# Altium project Module_sim.PrjPcb
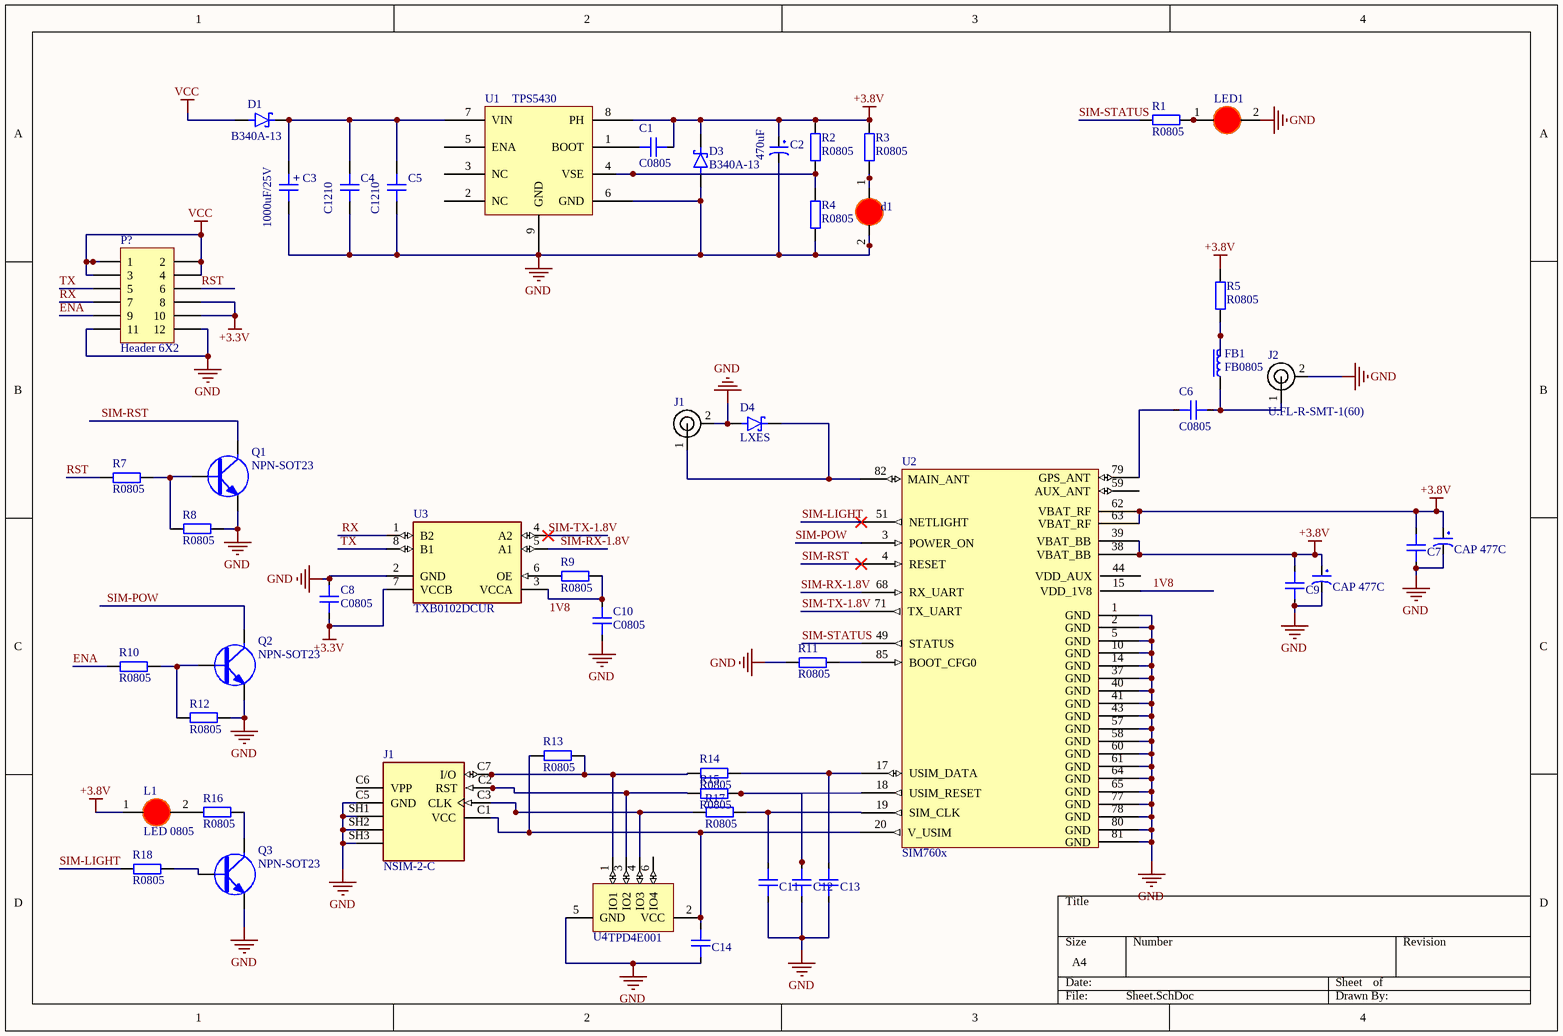
[diagram p0: Sheet.SchDoc]
1 sheet, 51 parts. Net scope: global (net labels, ports and power ports of the same name join across sheets).
Board file: PCB1.PcbDoc

## Sheet Sheet.SchDoc
size A4; SheetNumber: 1; SheetTotal: 1

### Parts
(Parts that share a designator on the sheet are numbered #1, #2 ... from top to bottom, then left to right.)
C1  C0805  [CAP_0805]
C2  470uF  [tu tantalum smd7343]
C3  1000uF/25V  [CAP_AE_SMD_D6MM3_H5M55]
C4  C1210  [CAP_1210]
C5  C1210  [CAP_1210]
C6  C0805  [CAP_0805]
C7  C0805  [CAP_0805]  (value not drawn)
C8  C0805  [CAP_0805]
C9  C0805  [CAP_0805]  (value not drawn)
C10  C0805  [CAP_0805]
C11  C0805  [CAP_0805]  (value not drawn)
C12  C0805  [CAP_0805]  (value not drawn)
C13  C0805  [CAP_0805]  (value not drawn)
C14  C0805  [CAP_0805]  (value not drawn)
D1#1  B340A-13  [B340A]
d1#2  LED_0805_RED  [LED-0805-Red]  (value not drawn)
D3  B340A-13  [B340A]
D4  LXES  [B340A]
FB1  FB0805  [FB_0805]
J1#1  U.FL-R-SMT-1(60)  [U.FL-R-SMT-1(60)]  (value not drawn)
J1#2  NSIM-2-C  [CUI_NSIM-2-C]
J2  U.FL-R-SMT-1(60)  [U.FL-R-SMT-1(60)]
L1  LED 0805  [LED-0805-Red]
LED1  LED 0805  [LED-0805-Red]  (value not drawn)
P?  Header 6X2  [HDR2X6]
Q1  NPN-SOT23  [SOT23 - 3PIN]
Q2  NPN-SOT23  [SOT23 - 3PIN]
Q3  NPN-SOT23  [SOT23 - 3PIN]
R1  R0805  [RES_0805]
R2  R0805  [RES_0805]
R3  R0805  [RES_0805]
R4  R0805  [RES_0805]
R5  R0805  [RES_0805]
R7  R0805  [RES_0805]
R8  R0805  [RES_0805]
R9  R0805  [RES_0805]
R10  R0805  [RES_0805]
R11  R0805  [RES_0805]
R12  R0805  [RES_0805]
R13  R0805  [RES_0805]
R14  R0805  [RES_0805]
R15  R0805  [RES_0805]
R16  R0805  [RES_0805]
R17  R0805  [RES_0805]
R18  R0805  [RES_0805]
Tụ_tantalum_1  CAP 477C  [tu tantalum smd7343]
Tụ_tantalum_2  CAP 477C  [tu tantalum smd7343]
U1  TPS5430  [TPS5430DDAR]
U2  SIM760x  [SIM7600CE]
U3  TXB0102DCUR  [txb0102]
U4  TPD4E001  [TSOT-26-6]

### Nets
+3.3V: C8.1 P?.8 P?.10 U3.7(VCCB)
+3.8V: C1.2 C2.1 C7.1 C9.1 D3.C L1.1(A) R2.2 R3.2 R5.2 Tụ_tantalum_1.1 Tụ_tantalum_2.1 U1.8(PH) U2.38(VBAT_BB) U2.39(VBAT_BB) U2.62(VBAT_RF) U2.63(VBAT_RF)
GND: C2.2 C3.2 C4.1 C5.1 C7.2 C8.2 C9.2 C10.2 C11.1 C12.1 C13.1 C14.1 d1#2.2(K) D3.A D4.A J1#1.2 J1#2.C5(GND) J1#2.SH1(CASE_GND) J1#2.SH2(CASE_GND) J1#2.SH3(CASE_GND) J2.2 LED1.2(K) P?.11 P?.12 Q1.2(E) Q2.2(E) Q3.2(E) R4.1 R8.1 R11.2 R12.1 Tụ_tantalum_1.2 Tụ_tantalum_2.2 U1.6(GND) U1.9(GND) U2.1(GND) U2.2(GND) U2.5(GND) U2.10(GND) U2.14(GND) U2.37(GND) U2.40(GND) U2.41(GND) U2.43(GND) U2.57(GND) U2.58(GND) U2.60(GND) U2.61(GND) U2.64(GND) U2.65(GND) U2.77(GND) U2.78(GND) U2.80(GND) U2.81(GND) U3.2(GND) U4.5(GND)
VCC: D1#1.A P?.1 P?.2 P?.3 P?.4
1V8: C10.1 R9.1 U2.15(VDD_1V8) U3.3(VCCA)
ENA: P?.9 R10.2
RST: P?.6 R7.2
RX: P?.7 U3.1(B2)
SIM-LIGHT: R18.2 U2.51(NETLIGHT)
SIM-POW: Q2.3(C) U2.3(POWER_ON)
SIM-RST: Q1.3(C) U2.4(RESET)
SIM-RX-1.8V: U2.68(RX_UART) U3.5(A1)
SIM-STATUS: R1.2 U2.49(STATUS)
SIM-TX-1.8V: U2.71(TX_UART) U3.4(A2)
TX: P?.5 U3.8(B1)
NetC1_1: C1.1 U1.1(BOOT)
NetC3_1: C3.1 C4.2 C5.2 D1#1.C U1.7(VIN)
NetC6_1: C6.1 U2.79(GPS_ANT)
NetC6_2: C6.2 FB1.1 J2.1
NetC11_2: C11.2 R17.1 U2.19(SIM_CLK)
NetC12_2: C12.2 R15.1 U2.18(USIM_RESET)
NetC13_2: C13.2 R14.1 U2.17(USIM_DATA)
NetC14_2: C14.2 J1#2.C1(VCC) R13.2 U2.20(V_USIM) U4.2(VCC)
Netd1#2_1: d1#2.1(A) R3.1
NetD4_C: D4.C J1#1.1 U2.82(MAIN_ANT)
NetFB1_2: FB1.2 R5.1
NetJ1#2_C2: J1#2.C2(RST) R15.2 U4.3(IO2)
NetJ1#2_C3: J1#2.C3(CLK) R17.2 U4.4(IO3)
NetJ1#2_C7: J1#2.C7(I/O) R13.1 R14.2 U4.1(IO1)
NetL1_2: L1.2(K) R16.2
NetLED1_1: LED1.1(A) R1.1
NetQ1_1: Q1.1(B) R7.1 R8.2
NetQ2_1: Q2.1(B) R10.1 R12.2
NetQ3_1: Q3.1(B) R18.1
NetQ3_3: Q3.3(C) R16.1
NetR2_1: R2.1 R4.2 U1.4(VSE)
NetR9_2: R9.2 U3.6(OE)
NetR11_1: R11.1 U2.85(BOOT_CFG0)

Not connected (* = marked no-connect by the designer): J1#2 C6(VPP); U1 2(NC) 3(NC) 5(ENA); U2 44(VDD_AUX) 59(AUX_ANT); U4 6(IO4)

### Notes on the sheet
- (in symbol CAP_ALEL_6.3x5.5) +

### Library data of the parts
C1 C6-C14 = CAP_0805: Capacitor SMD 0805; Manufacturer: *; Manufacturer Part Number: *; Distributor Link: *; LCSC: *; Rating: *; Dielectric: *
C2 = cap_tantan
C3 = CAP_ALEL_6.3x5.5: Capacitor SMD Aluminium Electrolytic 6.3mm Diameter 5.5mm Height; Manufacturer: *; Manufacturer Part Number: *; Distributor Link: *; LCSC: *
C4 C5 = CAP_1210: Capacitor SMD 1210; Manufacturer: *; Manufacturer Part Number: *; Distributor Link: *; LCSC: *; Rating: *; Dielectric: *
D1#1 D3 D4 = B340A-13: Diode Schottky 40 V 3A Surface Mount SMA; MF: Diodes Inc.; Value: *; MP: B340A-13; Package: DO-214 Diodes Inc.; Availability: In Stock; Price: None; SnapEDA_Link: https://www.snapeda.com/parts/B340A-13/Diodes+Inc./view-part/?ref=snap; Check_prices: https://www.snapeda.com/parts/B340A-13/Diodes+Inc./view-part/?ref=eda; Purchase-URL: https://pricing.snapeda.com/search/part/B340A-13/?ref=eda
FB1 = FB_0805: Ferrite Bead SMD 0805; Manufacturer: *; Manufacturer Part Number: *; Distributor Link: *; LCSC: *
J1#1 J2 = ANT-SMD: RF Connector u.FL 50 Ohms 6 GHz; Manufacturer: Hirose Connector; Manufacturer Part Number: U.FL-R-SMT-1(60)
J1#2 = NSIM-2-C: Nano SIM Card Connectors, 6 Positions, Connector, Hinged, Surface Mount, 1.4 mm Height Above Board, Gold Flash; MF: Same Sky; SnapEDA_Link: https://www.snapeda.com/parts/NSIM-2-C/Same+Sky/view-part/?ref=snap; Package: None; Value: *; MP: NSIM-2-C; Check_prices: https://www.snapeda.com/parts/NSIM-2-C/Same+Sky/view-part/?ref=eda
L1 LED1 = LED 0805 Do: Dán; Don_Vi: Con; Ma_Hang: MH000897; Ten_Linh_Kien: LED 0805 Màu Đỏ (Red); Ghi_Chu: *; Kieu_Chan: *; Chung_Loai: Dán
R1-R5 R7-R18 = RES_0805: Resistor SMD 0805; Manufacturer: *; Manufacturer Part Number: *; Distributor Link: *; LCSC: *
Tụ_tantalum_1 Tụ_tantalum_2 = CAP 477C: Tụ tantalum 7343 477C 16V 470uF 7.3x4.3mm
U3 = TXB0102DCUR: 2-Bit Bidirectional Voltage-Level Shifter with Auto Direction Sensing and +/-15-kV ESD Protect 8-VSSOP -40 to 85; MF: Texas Instruments; Digi-Key_Part_Number: 296-22862-1-ND; MP: TXB0102DCUR; Value: *; SnapEDA_Link: https://www.snapeda.com/parts/TXB0102DCUR/Texas%20Instruments/view-part/350005/?ref=snap; DigiKey-Purchase-URL: https://snapeda.com/shop?store=DigiKey&id=350005; Package: VSSOP-8 Texas Instruments; Texas_Instruments-Purchase-URL: https://snapeda.com/shop?store=Texas+Instruments&id=350005; Mouser-Purchase-URL: https://snapeda.com/shop?store=Mouser&id=350005
P? = Header 6X2: LatestRevisionDate: 17-Jul-2002; LatestRevisionNote: Re-released for DXP Platform.; Publisher: Altium Limited